# EAGLE design IR_daisy_link_v2 (EAGLE 5.11)
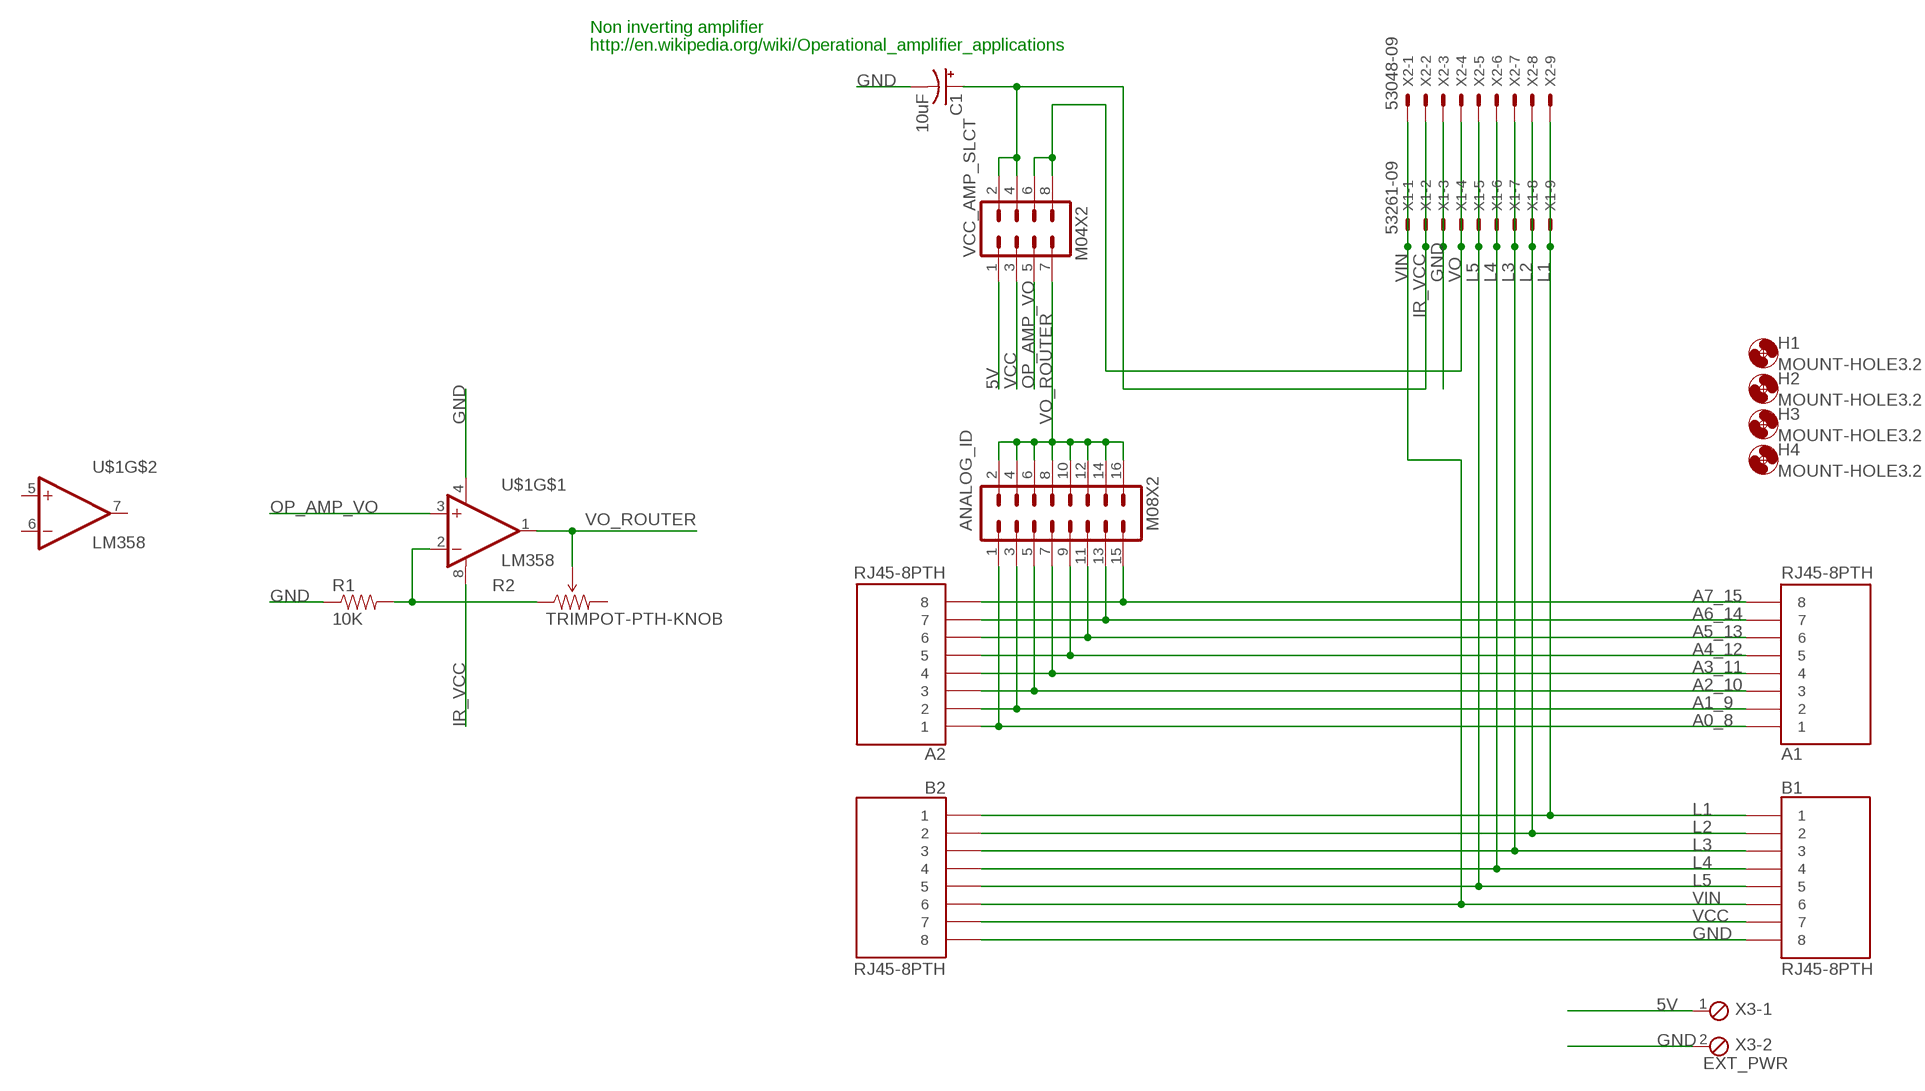
[diagram p0: schematic, sheet 1]

## Parts
A1  RJ45-8PTH  [RJ45-8]
A2  RJ45-8PTH  [RJ45-8]
ANALOG_ID  M08X2  [2X8]
B1  RJ45-8PTH  [RJ45-8]
B2  RJ45-8PTH  [RJ45-8]
C1  10uF  CAP_POLPTH2  [CPOL-RADIAL-10UF-25V]
H1  MOUNT-HOLE3.2  [3,2]
H2  MOUNT-HOLE3.2  [3,2]
H3  MOUNT-HOLE3.2  [3,2]
H4  MOUNT-HOLE3.2  [3,2]
R1  10K  RESISTOR1206  [1206]
R2  TRIMPOT-PTH-KNOB  [3386U]
U$1  LM358  [DIP08]
VCC_AMP_SLCT  M04X2  [2X4]
X1  53261-09  [53261-09]
X2  53048-09  [53048-09]
X3  EXT_PWR  MPT2  [2POL254]

## Nets
5V: VCC_AMP_SLCT.1 X3.1
A0_8: A1.1 A2.1 ANALOG_ID.1
A1_9: A1.2 A2.2 ANALOG_ID.3
A2_10: A1.3 A2.3 ANALOG_ID.5
A3_11: A1.4 A2.4 ANALOG_ID.7
A4_12: A1.5 A2.5 ANALOG_ID.9
A5_13: A1.6 A2.6 ANALOG_ID.11
A6_14: A1.7 A2.7 ANALOG_ID.13
A7_15: A1.8 A2.8 ANALOG_ID.15
GND: B1.8 B2.8 C1.2(-) R1.1 U$1.4(V-) X1.3 X2.3 X3.2
IR_VCC: C1.1(+) U$1.8(V+) VCC_AMP_SLCT.2 VCC_AMP_SLCT.4 X1.2 X2.2
L1: B1.1 B2.1 X1.9 X2.9
L2: B1.2 B2.2 X1.8 X2.8
L3: B1.3 B2.3 X1.7 X2.7
L4: B1.4 B2.4 X1.6 X2.6
L5: B1.5 B2.5 X1.5 X2.5
N$1: R1.2 R2.1(CCW) U$1.2(-IN)
OP_AMP_VO: U$1.3(+IN) VCC_AMP_SLCT.5
VCC: B1.7 B2.7 VCC_AMP_SLCT.3
VIN: B1.6 B2.6 X1.1 X2.1
VO: VCC_AMP_SLCT.6 VCC_AMP_SLCT.8 X1.4 X2.4
VO_ROUTER: ANALOG_ID.2 ANALOG_ID.4 ANALOG_ID.6 ANALOG_ID.8 ANALOG_ID.10 ANALOG_ID.12 ANALOG_ID.14 ANALOG_ID.16 R2.2(WIPER) U$1.1(OUT) VCC_AMP_SLCT.7
Unconnected: R2.3(CW) U$1.5(+IN) U$1.6(-IN) U$1.7(OUT)

## Notes on the sheet
- Non inverting amplifier
- http://en.wikipedia.org/wiki/Operational_amplifier_applications

## Library data of the parts
A1 A2 B1 B2 = SparkFun:RJ45-8: RJ45 Jack Simple RJ45, 8-pin connection - connector for common Cat5, Cat5e, and Cat6 Ethernet cables. Footprint not yet proven in production. Connector sku is PRT-00643; Breakout PCB sku is BOB-00716.
ANALOG_ID = SparkFun:M08X2
C1 = SparkFun:CAP_POL: Capacitor Polarized These are standard SMD and PTH capacitors. Normally 10uF, 47uF, and 100uF in electrolytic and tantalum varieties. Always verify the external diameter of the through hole cap, it varies with capacity, voltage, and manufacturer. The EIA devices should be standard.
H1-H4 = holes:MOUNT-HOLE: MOUNTING HOLE with drill center marker
R1 = SparkFun:RESISTOR: Resistor Basic schematic elements and footprints for 0603, 1206, and PTH resistors.
R2 = SparkFun:TRIMPOT
U$1 = SparkFun:LM358
VCC_AMP_SLCT = SparkFun:M04X2
X1 = con-molex:53?-09: CONNECTOR wire to board 1.25 mm (.049 inch) pitch header; MPN: 53261-0971; OC_FARNELL: 1125362; OC_NEWARK: 93K4249
X2 = con-molex:53?-09: CONNECTOR wire to board 1.25 mm (.049 inch) pitch header; MPN: 53048-0910; OC_FARNELL: 1012239; OC_NEWARK: 98K9837
X3 = con-phoenix-254:MPT2: PHOENIX CONNECTOR; OC_FARNELL: unknown; OC_NEWARK: unknown

## Board
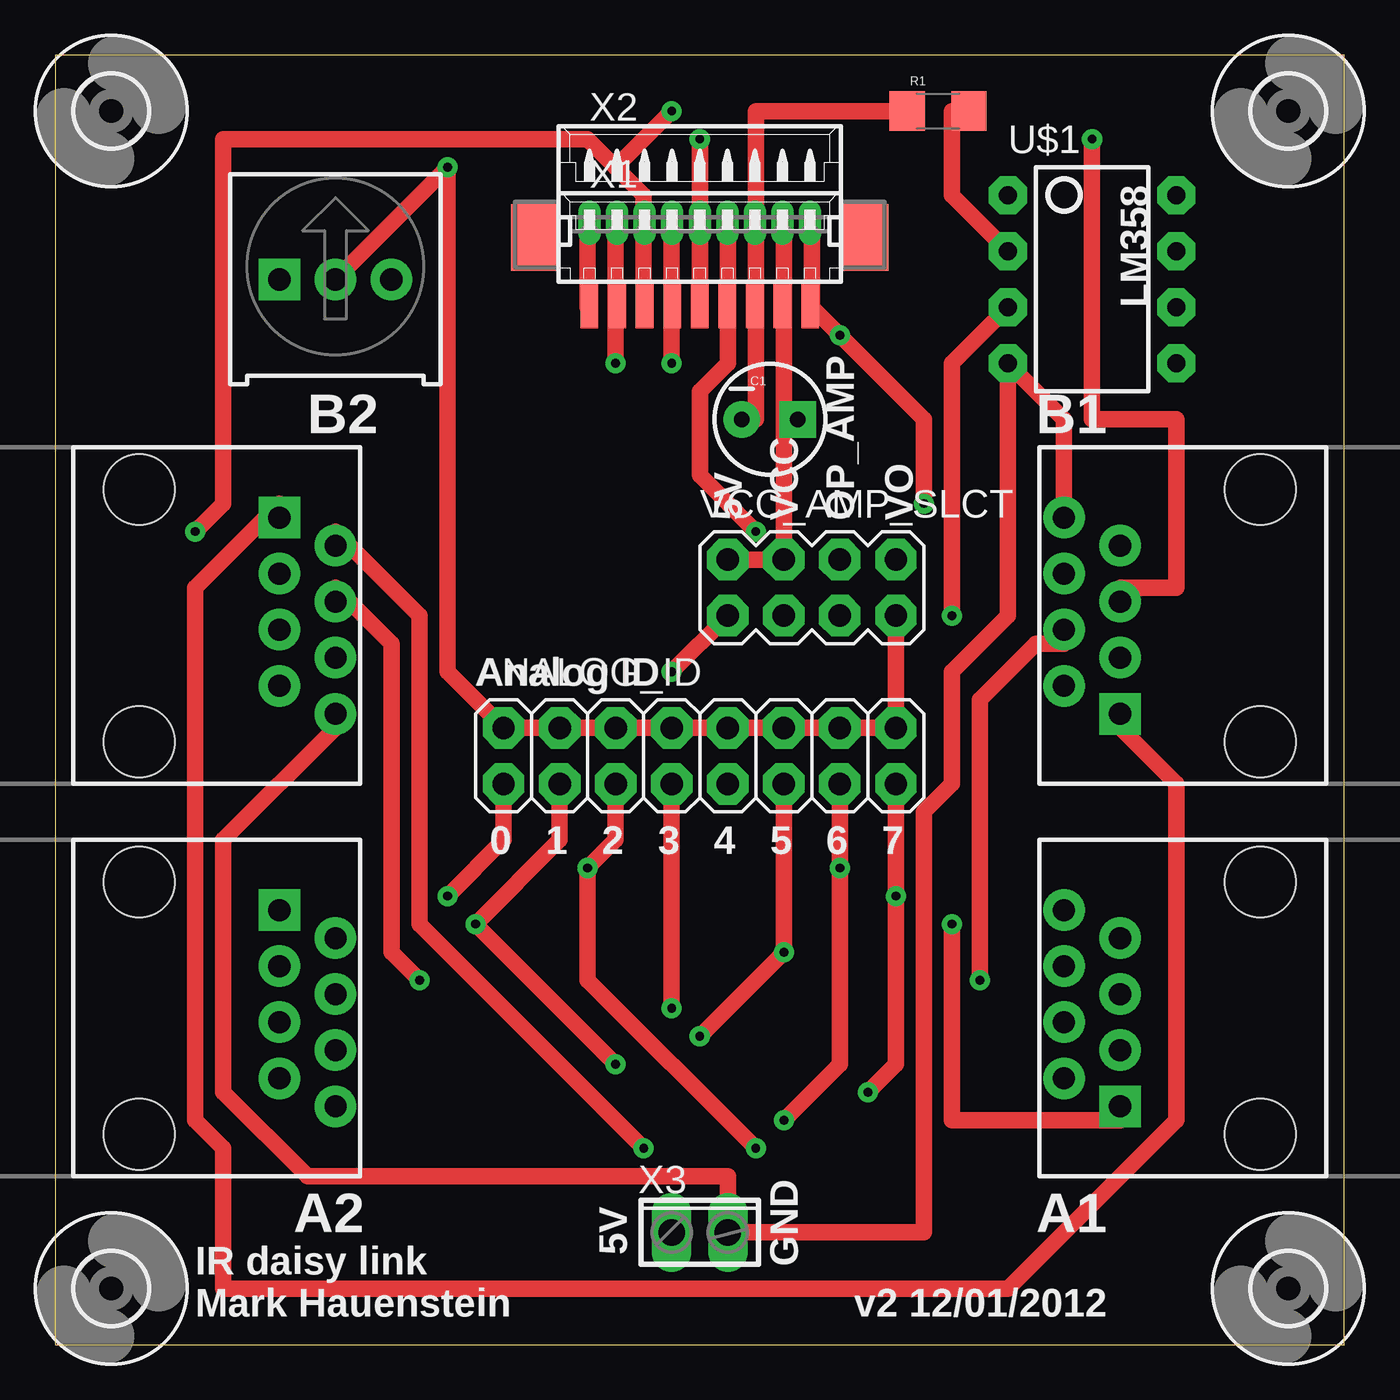
[diagram p1: board, top side]
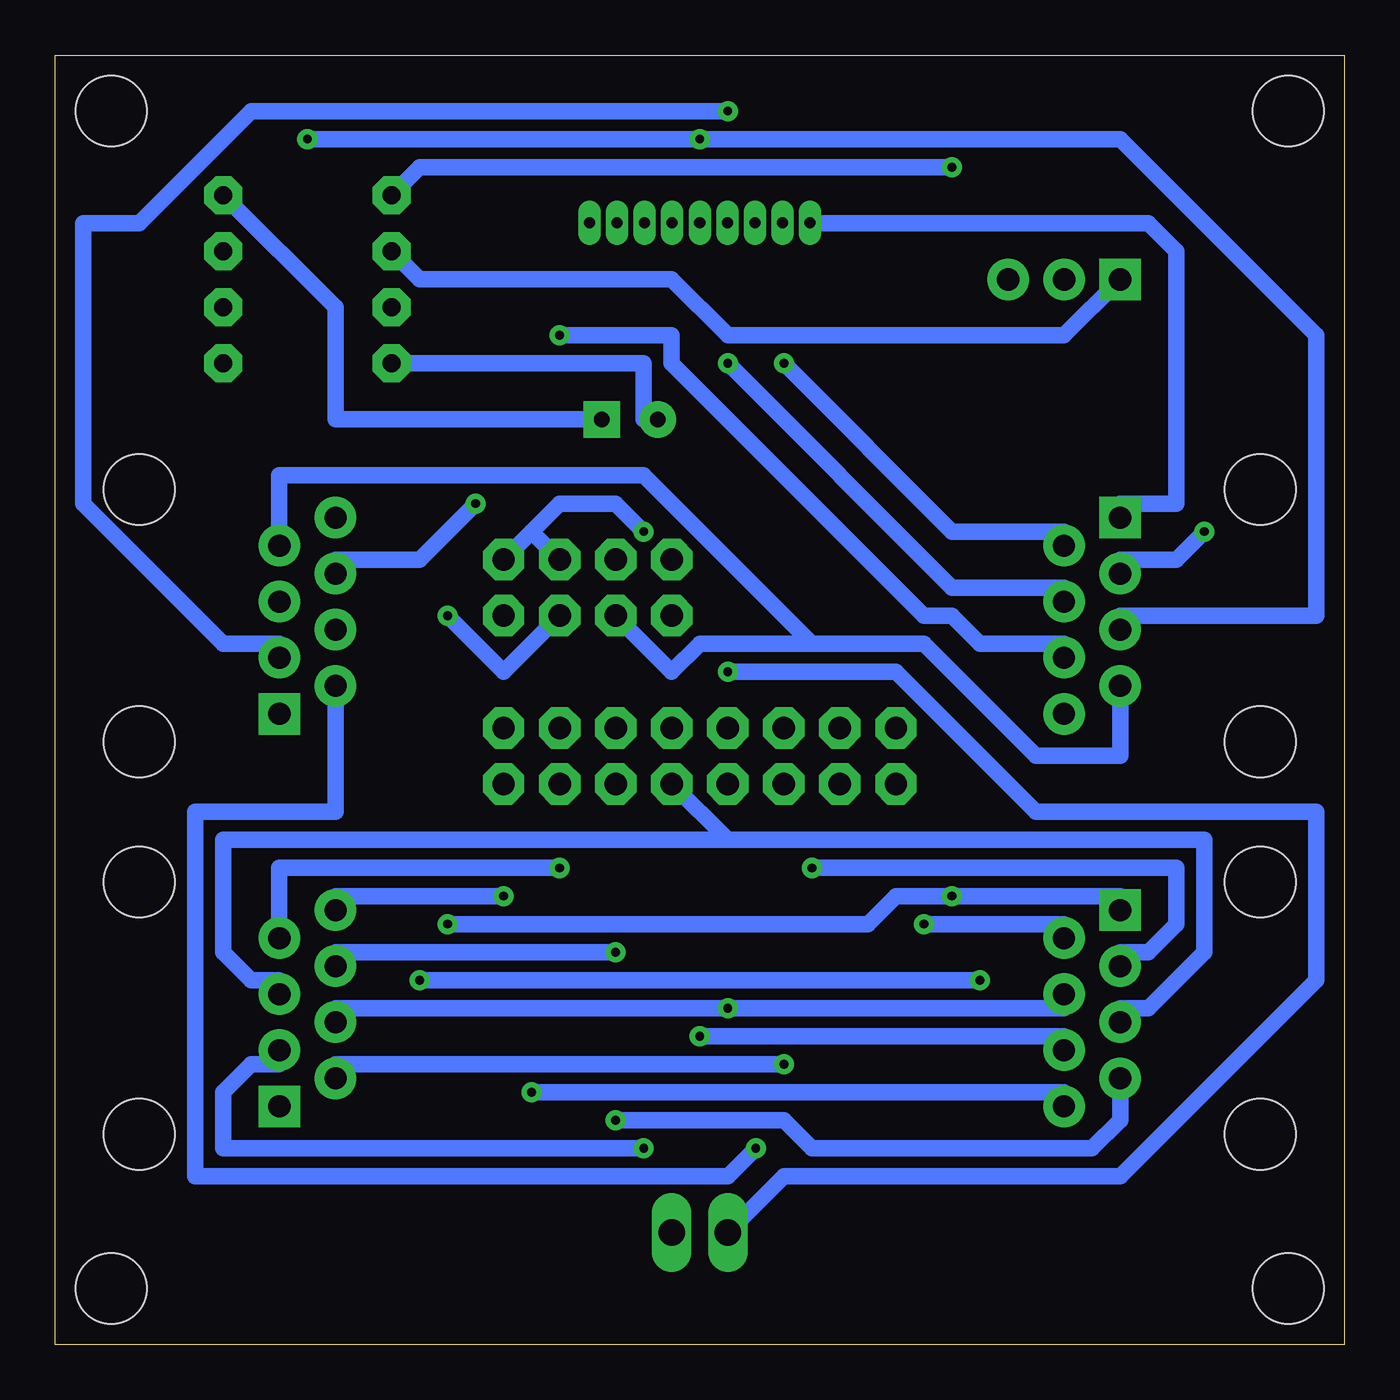
[diagram p2: board, bottom side, seen from below]

Size 58.42 x 58.41 mm. Coordinates in mm from the lower left corner, seen from the top.
Outline: 58.42,0 58.42,58.41 0,58.41 0,0 58.42,0
Copper layers (1*16): Top 0.035mm / dielectric 1.5mm / Bottom 0.035mm
Design rules "pcbtrain *": minimum track width 0.75mm, minimum drill 0.4mm, track to track 0.2mm, track to pad 0.2mm, pad to pad 0.2mm, via to via 0.2mm, smd to smd 0mil, copper to edge 10mil, drill to drill 0.2mm, minimum pad ring 10mil, minimum via ring 10mil, stop-mask expansion 0.125mm, vias tented up to drill 0mil, thermal gap 10mil

### Footprints (pad centres in the part's own frame; a part is rotated, then mirrored left to right if it is on the bottom)
RJ45-8 = drill 1 pad 1.88 square: 1 -4.445,6.35 | drill 1 pad 1.88 round: 2 -3.175,8.89; 3 -1.905,6.35; 4 -0.635,8.89; 5 0.635,6.35; 6 1.905,8.89; 7 3.175,6.35; 8 4.445,8.89 | hole 3.2: -5.715,0; 5.715,0
2X8 = drill 1.016 pad 1.88 octagon: 1 0,0; 2 0,2.54; 3 2.54,0; 4 2.54,2.54; 5 5.08,0; 6 5.08,2.54; 7 7.62,0; 8 7.62,2.54; 9 10.16,0; 10 10.16,2.54; 11 12.7,0; 12 12.7,2.54; 13 15.24,0; 14 15.24,2.54; 15 17.78,0; 16 17.78,2.54
CPOL-RADIAL-10UF-25V = drill 0.7 pad 1.651 square: 1 1.27,0 | drill 0.7 pad 1.651 round: 2 -1.27,0
3,2 = hole 3.2: 0,0
1206 = smd 1.6 x 1.8: 1 -1.4,0; 2 1.4,0
3386U = drill 1.016 pad 1.88 square: 1 -2.54,-0.015 | drill 1.016 pad 1.88 round: 2 0,-0.015; 3 2.54,-0.015
DIP08 = drill 0.813 pad 1.727 octagon: 1 -3.81,-3.81; 2 -1.27,-3.81; 3 1.27,-3.81; 4 3.81,-3.81; 5 3.81,3.81; 6 1.27,3.81; 7 -1.27,3.81; 8 -3.81,3.81
2X4 = drill 1.016 pad 1.88 octagon: 1 -3.81,-1.27; 2 -3.81,1.27; 3 -1.27,-1.27; 4 -1.27,1.27; 5 1.27,-1.27; 6 1.27,1.27; 7 3.81,-1.27; 8 3.81,1.27
53261-09 = smd 0.8 x 2: 1 5,-2.5; 2 3.75,-2.5; 3 2.5,-2.5; 4 1.25,-2.5; 5 0,-2.5; 6 -1.25,-2.5; 7 -2.5,-2.5; 8 -3.75,-2.5; 9 -5,-2.5 | smd 2.1 x 3: S1 7.5,0.625; S2 -7.5,0.625
53048-09 = drill 0.5 pad 0.698 long: 1 5,-1.25; 2 3.75,-1.25; 3 2.5,-1.25; 4 1.25,-1.25; 5 0,-1.25; 6 -1.25,-1.25; 7 -2.5,-1.25; 8 -3.75,-1.25; 9 -5,-1.25
2POL254 = drill 1.2 long: 1 -1.27,0; 2 1.27,0

### Placement (x,y rotation side)
A1  54.61,15.24 90 top
A2  3.81,15.24 270 top
ANALOG_ID  20.32,25.4 0 top
B1  54.61,33.02 90 top
B2  3.81,33.02 270 top
C1  32.38,41.91 0 top
H1  55.88,2.54 0 top
H2  2.54,2.54 0 top
H3  55.88,55.88 0 top
H4  2.54,55.88 0 top
R1  40.01,55.88 0 top
R2  12.7,48.26 0 top
U$1  46.99,48.26 270 top
VCC_AMP_SLCT  34.29,34.29 0 top
X1  29.21,49.53 0 top
X2  29.21,52.07 0 top
X3  29.21,5.08 0 top

### Tracks (layer width: path | path; a pad name or v marks a point on that pad's centre or on a via)
5V  (via drill 0.4)
  Top 0.75: v27.94,30.48 VCC_AMP_SLCT.1
  Bottom 0.75: X3.1 25.4,7.62 10.16,7.62 1.27,16.51 1.27,24.13 13.97,24.13 20.32,30.48 v27.94,30.48
A0_8  (via drill 0.4)
  Top 0.75: v17.78,20.32 20.32,22.86 ANALOG_ID.1 | v40.64,19.05 40.64,10.16 48.26,10.16 A1.1
  Bottom 0.75: A2.1 10.16,20.32 v17.78,20.32 20.32,20.32 21.59,19.05 v40.64,19.05
A1_9  (via drill 0.4)
  Top 0.75: ANALOG_ID.3 22.86,22.86 v19.05,19.05 v25.4,12.7
  Bottom 0.75: v19.05,19.05 12.7,19.05 A2.2 | v25.4,12.7 45.72,12.7 A1.2
A2_10  (via drill 0.4)
  Top 0.75: ANALOG_ID.5 25.4,22.86 v24.13,21.59 24.13,16.51 v31.75,8.89
  Bottom 0.75: v24.13,21.59 7.62,21.59 7.62,19.05 8.89,17.78 10.16,17.78 A2.3 | v31.75,8.89 50.8,8.89 50.8,11.43 49.53,12.7 48.26,12.7 A1.3
A3_11  (via drill 0.4)
  Top 0.75: v27.94,15.24 ANALOG_ID.7
  Bottom 0.75: A2.4 12.7,15.24 v27.94,15.24 45.72,15.24 A1.4
A4_12
  Bottom 0.75: 27.94,22.86 6.35,22.86 6.35,17.78 8.89,15.24 10.16,15.24 A2.5 | 27.94,22.86 ANALOG_ID.9 | 27.94,22.86 50.8,22.86 50.8,17.78 49.53,16.51 48.26,16.51 A1.5
A5_13  (via drill 0.4)
  Top 0.75: v29.21,13.97 v33.02,17.78 ANALOG_ID.11
  Bottom 0.75: v29.21,13.97 12.7,13.97 A2.6 | v33.02,17.78 45.72,17.78 A1.6
A6_14  (via drill 0.4)
  Top 0.75: v33.02,10.16 35.56,12.7 v35.56,21.59 ANALOG_ID.13
  Bottom 0.75: v33.02,10.16 25.4,10.16 24.13,8.89 11.43,8.89 10.16,10.16 A2.7 | v35.56,21.59 48.26,21.59 A1.7
A7_15  (via drill 0.4)
  Top 0.75: v36.83,11.43 38.1,12.7 v38.1,20.32 ANALOG_ID.15
  Bottom 0.75: v36.83,11.43 12.7,11.43 A2.8 | v38.1,20.32 45.72,20.32 A1.8
GND
  Top 0.75: 31.75,50.8 31.75,55.88 R1.1 | 31.75,46.99 31.75,50.8 | 31.75,50.8 X2.3 | 31.75,46.99 31.75,41.91 C1.2 | 31.75,46.99 X1.3 | B1.8 45.72,41.91 U$1.4 43.18,33.02 40.64,30.48 40.64,25.4 39.37,24.13 39.37,5.08 X3.2 30.48,7.62 11.43,7.62 7.62,11.43 7.62,22.86 12.7,27.94 B2.8
  Bottom 0.75: U$1.4 31.75,44.45 31.75,41.91 C1.2
IR_VCC
  Top 0.75: VCC_AMP_SLCT.2 VCC_AMP_SLCT.4 33.02,41.91 | 33.02,46.99 33.02,50.8 X2.2 | 33.02,41.91 33.02,46.99 | 33.02,46.99 X1.2 | 33.02,41.91 C1.1
  Bottom 0.75: U$1.8 45.72,46.99 45.72,41.91 C1.1
L1
  Top 0.75: X1.9 24.13,46.99 24.13,50.8 X2.9 | B1.1 48.26,27.94 50.8,25.4 50.8,10.16 43.18,2.54 7.62,2.54 7.62,8.89 6.35,10.16 6.35,34.29 10.16,38.1 B2.1
  Bottom 0.75: X2.9 24.13,50.8 8.89,50.8 7.62,49.53 7.62,38.1 10.16,38.1 B2.1
L2  (via drill 0.4)
  Top 0.75: 25.4,46.99 25.4,50.8 X2.8 | v25.4,44.45 25.4,46.99 | 25.4,46.99 X1.8 | v26.67,8.89 16.51,19.05 16.51,33.02 12.7,36.83 B2.2
  Bottom 0.75: v25.4,44.45 17.78,36.83 12.7,36.83 B2.2 | v26.67,8.89 27.94,7.62 52.07,7.62 52.07,24.13 45.72,24.13 B1.2
L3  (via drill 0.4)
  Top 0.75: 26.67,50.8 26.67,46.99 X1.7 | 26.67,50.8 26.67,52.07 25.4,53.34 | 25.4,53.34 24.13,54.61 7.62,54.61 7.62,38.1 v6.35,36.83 | 26.67,50.8 X2.7 | 25.4,53.34 v27.94,55.88
  Bottom 0.75: v6.35,36.83 7.62,35.56 10.16,35.56 B2.3 | v27.94,55.88 49.53,55.88 54.61,50.8 57.15,50.8 57.15,38.1 50.8,31.75 48.26,31.75 B1.3
L4  (via drill 0.4)
  Top 0.75: 27.94,46.99 27.94,50.8 X2.6 | v27.94,44.45 27.94,46.99 | 27.94,46.99 X1.6 | v41.91,16.51 41.91,29.21 44.45,31.75 45.72,31.75 B1.4 | v16.51,16.51 15.24,17.78 15.24,31.75 12.7,34.29 B2.4
  Bottom 0.75: v27.94,44.45 17.78,34.29 12.7,34.29 B2.4 | v16.51,16.51 v41.91,16.51
L5  (via drill 0.4)
  Top 0.75: 29.21,46.99 X1.5 X2.5 v29.21,54.61 | v46.99,54.61 46.99,41.91 50.8,41.91 50.8,34.29 48.26,34.29 B1.5
  Bottom 0.75: B2.5 10.16,33.02 1.27,33.02 1.27,45.72 10.16,54.61 v29.21,54.61 v46.99,54.61
N$1
  Top 0.75: U$1.2 40.64,52.07 40.64,55.88 R1.2
  Bottom 0.75: U$1.2 41.91,48.26 30.48,48.26 27.94,45.72 12.7,45.72 10.16,48.26 R2.1
OP_AMP_VO  (via drill 0.4)
  Top 0.75: U$1.3 40.64,44.45 v40.64,33.02
  Bottom 0.75: v40.64,33.02 38.1,30.48 VCC_AMP_SLCT.5
VCC
  Bottom 0.75: 24.13,31.75 29.21,31.75 30.48,30.48 VCC_AMP_SLCT.3 | 24.13,31.75 19.05,31.75 13.97,26.67 10.16,26.67 B2.7 | 24.13,31.75 31.75,39.37 48.26,39.37 B1.7
VIN  (via drill 0.4)
  Top 0.75: 34.29,46.99 34.29,50.8 X2.1 | 34.29,46.99 v35.56,45.72 39.37,41.91 v39.37,38.1 | 34.29,46.99 X1.1
  Bottom 0.75: v39.37,38.1 41.91,35.56 45.72,35.56 B1.6 | v35.56,45.72 30.48,45.72 30.48,44.45 19.05,33.02 17.78,33.02 16.51,31.75 12.7,31.75 B2.6
VO  (via drill 0.4)
  Top 0.75: 30.48,46.99 30.48,50.8 X2.4 | 30.48,46.99 30.48,44.45 29.21,43.18 29.21,39.37 v31.75,36.83 | 30.48,46.99 X1.4
  Bottom 0.75: v31.75,36.83 33.02,38.1 35.56,38.1 36.83,36.83 | 36.83,36.83 VCC_AMP_SLCT.8 | 36.83,36.83 VCC_AMP_SLCT.6
VO_ROUTER  (via drill 0.4)
  Top 0.75: VCC_AMP_SLCT.7 ANALOG_ID.16 ANALOG_ID.14 ANALOG_ID.12 ANALOG_ID.10 ANALOG_ID.8 ANALOG_ID.6 ANALOG_ID.4 ANALOG_ID.2 17.78,30.48 v17.78,53.34 12.7,48.26 R2.2
  Bottom 0.75: U$1.1 41.91,53.34 v17.78,53.34

### Text on the board
tPlace: LM358 | B2 | B1 | 5V | VCC | OP_AMP | VO | Analog ID | 0 | 1 | 2 | 3 | 4 | 5 | 6 | 7 | A2 | A1 | 5V | GND | IR daisy link | Mark Hauenstein | v2 12/01/2012